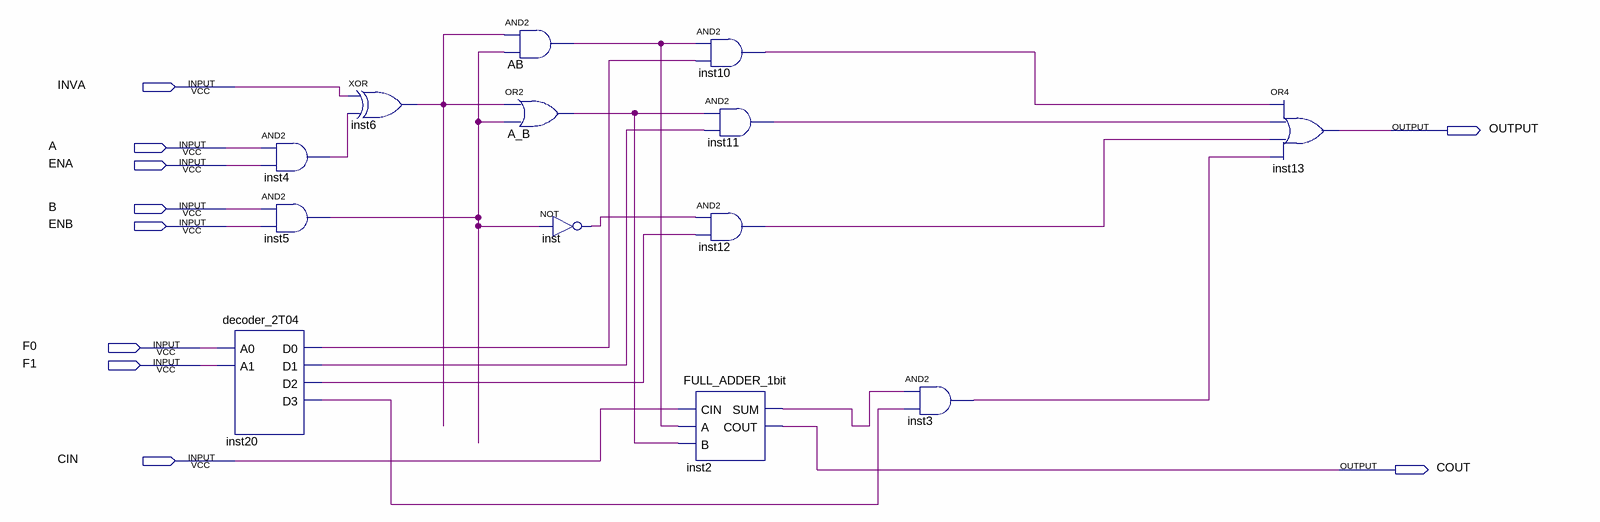
[diagram p0: schematic sheet]
// Quartus schematic ULA_1bit.bdf as structural Verilog: 13 symbols, 10 pins
module ULA_1bit (
  input  INVA,
  input  A,
  input  ENA,
  input  B,
  input  ENB,
  input  F0,
  input  F1,
  input  CIN,
  output OUTPUT,
  output COUT
);

  wire A_B_out, AB_out, inst2_sum, inst3_out, inst4_out, inst5_out, inst6_out, inst10_out, inst11_out,
       inst12_out, inst20_d0, inst20_d1, inst20_d2, inst20_d3, inst_out;

  decoder_2T04 inst20 (.A0(F0), .A1(F1), .D0(inst20_d0), .D1(inst20_d1), .D2(inst20_d2), .D3(inst20_d3));
  and inst4 (inst4_out, A, ENA);
  and inst5 (inst5_out, B, ENB);
  xor inst6 (inst6_out, INVA, inst4_out);
  and AB (AB_out, inst6_out, inst5_out);
  or A_B (A_B_out, inst6_out, inst5_out);
  not inst (inst_out, inst5_out);
  and inst10 (inst10_out, AB_out, inst20_d0);
  and inst11 (inst11_out, A_B_out, inst20_d1);
  and inst12 (inst12_out, inst_out, inst20_d2);
  FULL_ADDER_1bit inst2 (.CIN(CIN), .A(AB_out), .B(A_B_out), .SUM(inst2_sum), .COUT(COUT));
  and inst3 (inst3_out, inst2_sum, inst20_d3);
  or inst13 (OUTPUT, inst10_out, inst11_out, inst12_out, inst3_out);
endmodule
